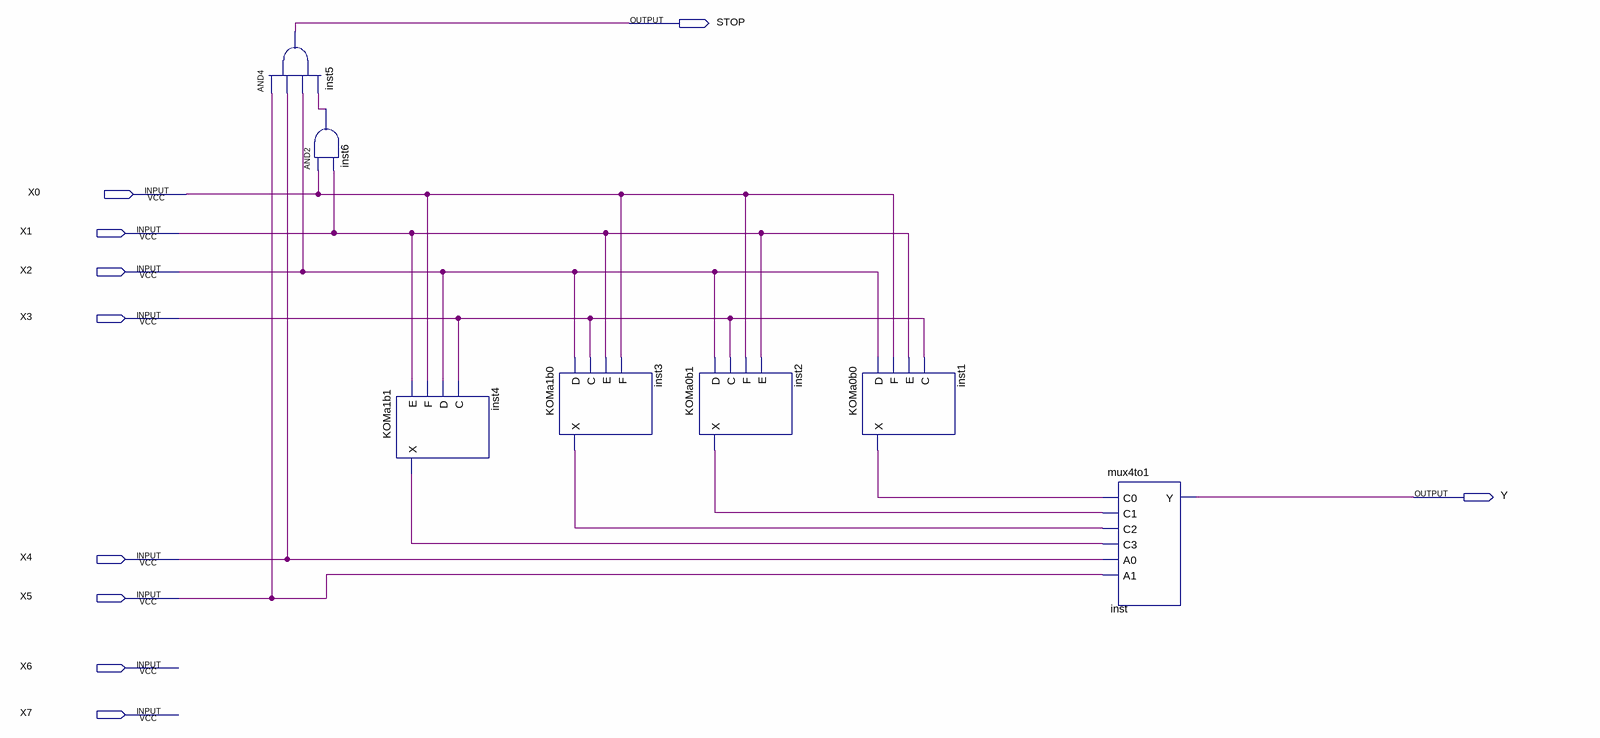
[diagram p0: schematic sheet]
// Quartus schematic KOM2.bdf as structural Verilog: 7 symbols, 10 pins
module KOM2 (
  input  X0,
  input  X1,
  input  X2,
  input  X3,
  input  X4,
  input  X5,
  input  X6,
  input  X7,
  output STOP,
  output Y
);

  wire inst1_x, inst2_x, inst3_x, inst4_x, inst6_out;

  and inst5 (STOP, X5, X4, X2, inst6_out);
  and inst6 (inst6_out, X0, X1);
  KOMa1b1 inst4 (.E(X1), .F(X0), .D(X2), .C(X3), .X(inst4_x));
  KOMa1b0 inst3 (.D(X2), .C(X3), .E(X1), .F(X0), .X(inst3_x));
  KOMa0b1 inst2 (.D(X2), .C(X3), .F(X0), .E(X1), .X(inst2_x));
  KOMa0b0 inst1 (.D(X2), .F(X0), .E(X1), .C(X3), .X(inst1_x));
  mux4to1 inst (.C0(inst1_x), .C1(inst2_x), .C2(inst3_x), .C3(inst4_x), .A0(X4), .A1(X5), .Y(Y));
endmodule
